# Altium schematic sheet Insight.SchDoc
size A4; SheetNumber: 1; SheetTotal: 5
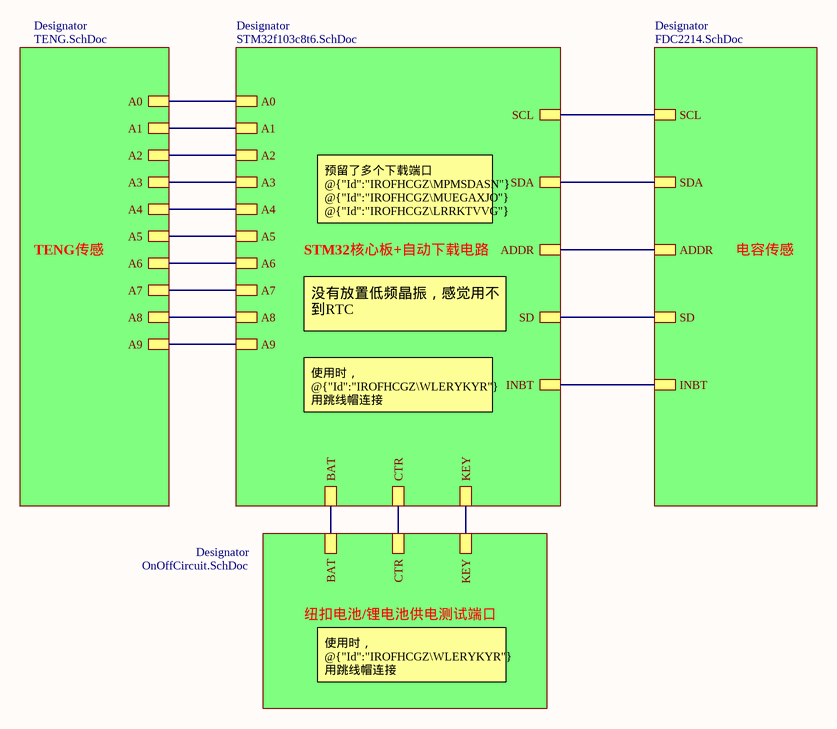
[diagram p0: Insight.SchDoc]

## Sub-sheets
Designator = STM32f103c8t6.SchDoc: A0, A1, A2, A3, A4, A5, A6, A7, A8, A9, SCL, SDA, ADDR, SD, INBT, BAT, CTR, KEY
Designator = FDC2214.SchDoc: SCL, SDA, SD, INBT, ADDR
Designator = TENG.SchDoc: A0, A1, A2, A3, A4, A5, A6, A7, A9, A8
Designator = OnOffCircuit.SchDoc: BAT, CTR, KEY

## Nets
(unnamed): sheet Designator/A0, sheet Designator/A0
(unnamed): sheet Designator/A1, sheet Designator/A1
(unnamed): sheet Designator/A2, sheet Designator/A2
(unnamed): sheet Designator/A3, sheet Designator/A3
(unnamed): sheet Designator/A4, sheet Designator/A4
(unnamed): sheet Designator/A5, sheet Designator/A5
(unnamed): sheet Designator/A6, sheet Designator/A6
(unnamed): sheet Designator/A7, sheet Designator/A7
(unnamed): sheet Designator/A8, sheet Designator/A8
(unnamed): sheet Designator/A9, sheet Designator/A9
(unnamed): sheet Designator/SCL, sheet Designator/SCL
(unnamed): sheet Designator/SDA, sheet Designator/SDA
(unnamed): sheet Designator/ADDR, sheet Designator/ADDR
(unnamed): sheet Designator/SD, sheet Designator/SD
(unnamed): sheet Designator/INBT, sheet Designator/INBT
(unnamed): sheet Designator/BAT, sheet Designator/BAT
(unnamed): sheet Designator/CTR, sheet Designator/CTR
(unnamed): sheet Designator/KEY, sheet Designator/KEY

## Notes on the sheet
- TENG传感
- STM32核心板+自动下载电路
- 预留了多个下载端口
  @{"Id":"IROFHCGZ\MPMSDASN"} @{"Id":"IROFHCGZ\MUEGAXJO"} @{"Id":"IROFHCGZ\LRRKTVVG"}
- 电容传感
- 没有放置低频晶振，感觉用不到RTC
- 使用时， @{"Id":"IROFHCGZ\WLERYKYR"}用跳线帽连接
  建议连接1，2引脚。
- 纽扣电池/锂电池供电测试端口
- 使用时， @{"Id":"IROFHCGZ\WLERYKYR"}用跳线帽连接
  建议连接2，3引脚。